# EAGLE design DimmerRGB_RevA (EAGLE 7.4.0)
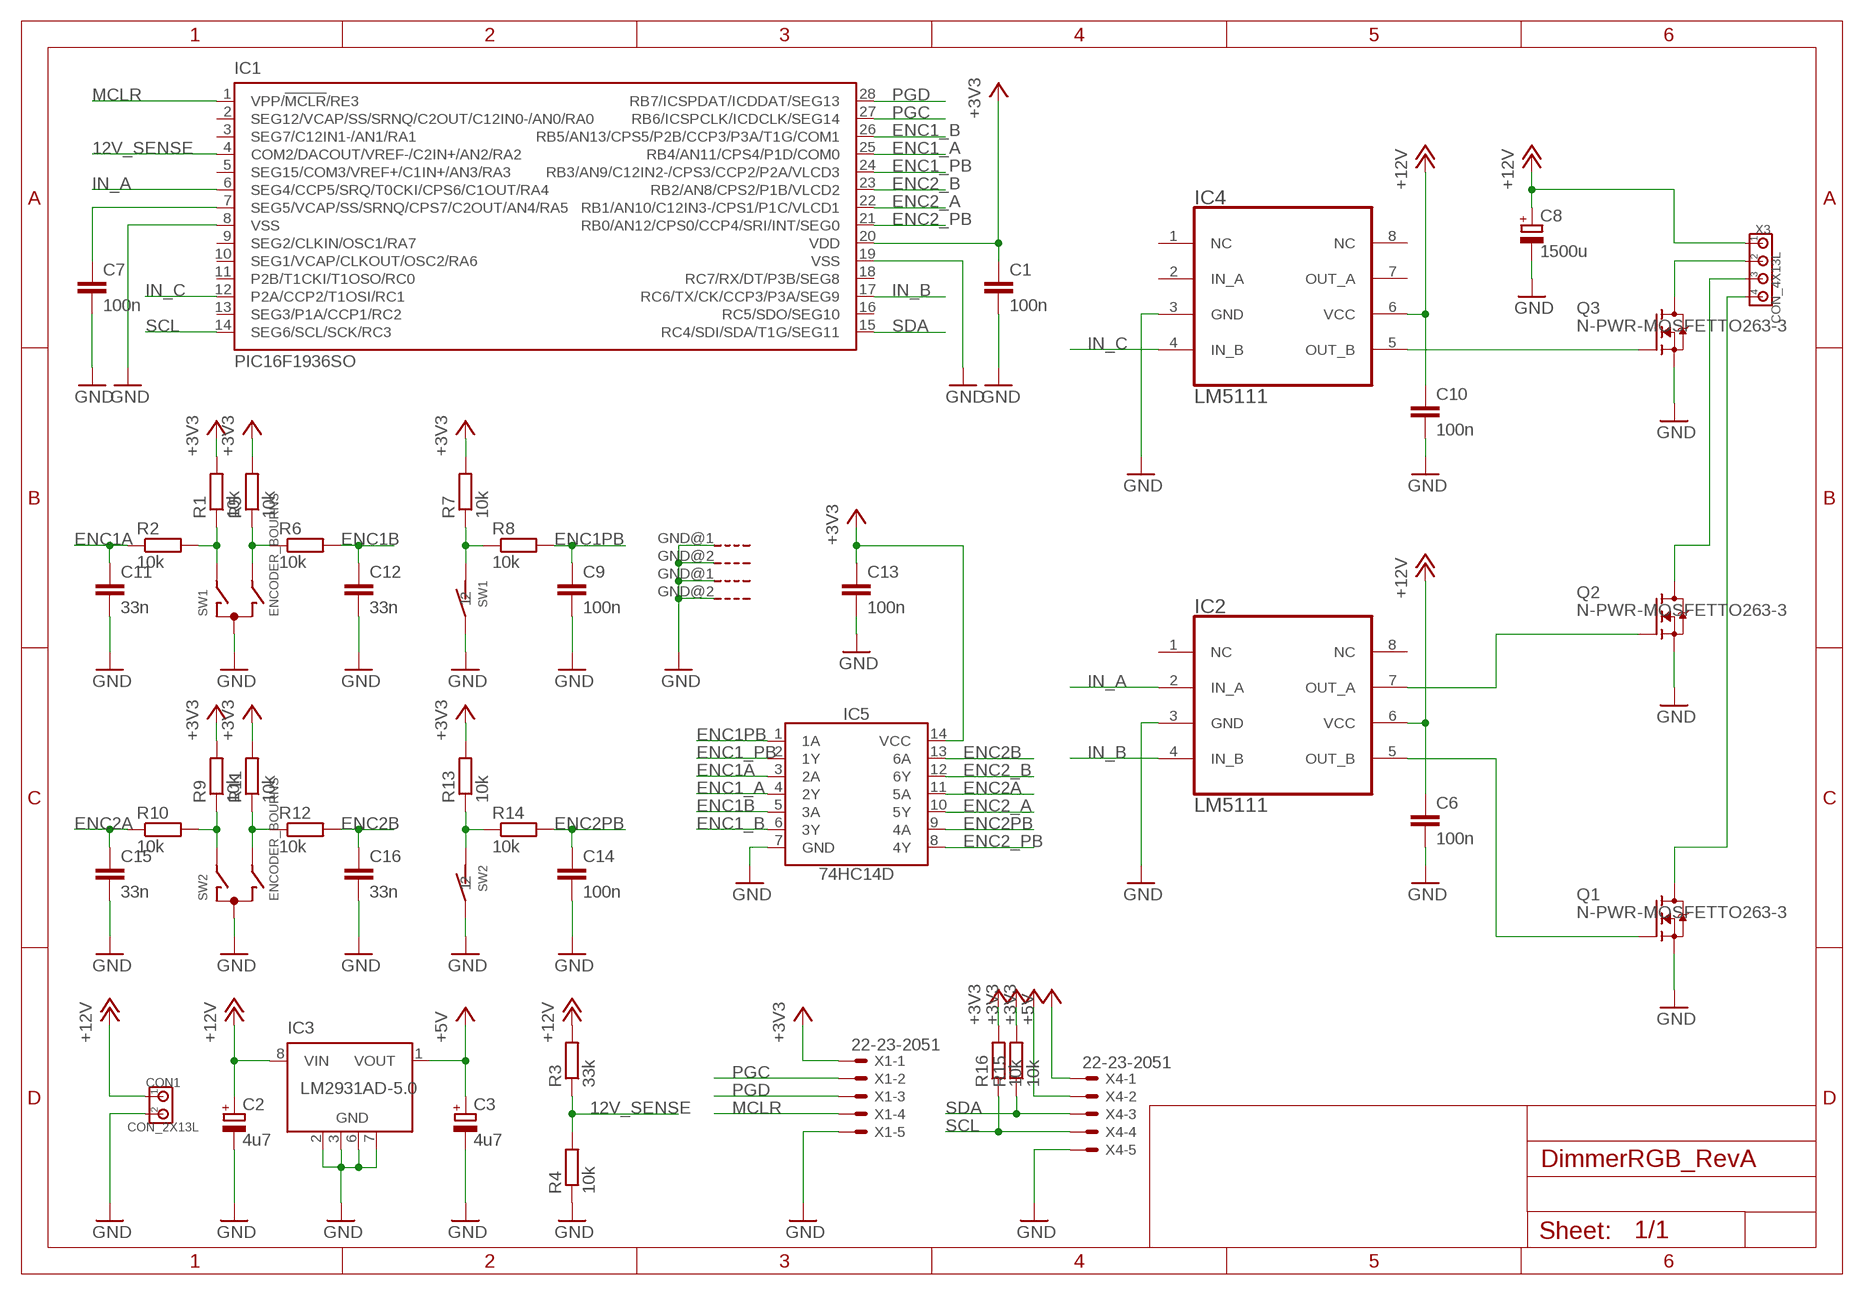
[diagram p0: schematic, sheet 1]

## Parts
C1  100n  CC0805  [C0805]
C2  4u7  C_POLARIZEDSMC_C  [SMC_C]
C3  4u7  C_POLARIZEDSMC_C  [SMC_C]
C6  100n  CC0805  [C0805]
C7  100n  CC0805  [C0805]
C8  1500u  C_POLARIZED10MM  [10MM]
C9  100n  CC0805  [C0805]
C10  100n  CC0805  [C0805]
C11  33n  CC0805  [C0805]
C12  33n  CC0805  [C0805]
C13  100n  CC0805  [C0805]
C14  100n  CC0805  [C0805]
C15  33n  CC0805  [C0805]
C16  33n  CC0805  [C0805]
CON1  CON_2X13L  [200MIL_2X]
IC1  PIC16F1936SO  [SO28W]
IC2  LM5111  [SOIC8]
IC3  LM2931AD-5.0  [SO8]
IC4  LM5111  [SOIC8]
IC5  74HC14D  [SO14]
Q1  N-PWR-MOSFETTO263-3  [TO263-3]
Q2  N-PWR-MOSFETTO263-3  [TO263-3]
Q3  N-PWR-MOSFETTO263-3  [TO263-3]
R1  10k  RESISTORR0805  [R0805]
R2  10k  RESISTORR0805  [R0805]
R3  33k  RESISTORR0805  [R0805]
R4  10k  RESISTORR0805  [R0805]
R5  10k  RESISTORR0805  [R0805]
R6  10k  RESISTORR0805  [R0805]
R7  10k  RESISTORR0805  [R0805]
R8  10k  RESISTORR0805  [R0805]
R9  10k  RESISTORR0805  [R0805]
R10  10k  RESISTORR0805  [R0805]
R11  10k  RESISTORR0805  [R0805]
R12  10k  RESISTORR0805  [R0805]
R13  10k  RESISTORR0805  [R0805]
R14  10k  RESISTORR0805  [R0805]
R15  10k  RESISTORR0805  [R0805]
R16  10k  RESISTORR0805  [R0805]
SW1  ENCODER_BOURNS  [ENCODER_BOURNS]
SW2  ENCODER_BOURNS  [ENCODER_BOURNS]
X1  22-23-2051  [22-23-2051]
X3  CON_4X13L  [200MIL_4X]
X4  22-23-2051  [22-23-2051]

## Nets
12V_SENSE: IC1.4(COM2/DACOUT/VREF-/C2IN+/AN2/RA2) R3.1 R4.2
+3V3: C1.1 C13.1 IC1.20(VDD) IC5.14(VCC) R1.2 R5.2 R7.2 R9.2 R11.2 R13.2 R15.2 R16.2 X1.1 X4.2
+5V: C3.+ IC3.1(VOUT) X4.1
+12V: C2.+ C6.1 C8.+ C10.1 CON1.1 IC2.6(VCC) IC3.8(VIN) IC4.6(VCC) R3.2 X3.1
ENC1_A: IC1.25(RB4/AN11/CPS4/P1D/COM0) IC5.4(2Y)
ENC1_B: IC1.26(RB5/AN13/CPS5/P2B/CCP3/P3A/T1G/COM1) IC5.6(3Y)
ENC1_PB: IC1.24(RB3/AN9/C12IN2-/CPS3/CCP2/P2A/VLCD3) IC5.2(1Y)
ENC1A: C11.1 IC5.3(2A) R2.1
ENC1B: C12.1 IC5.5(3A) R6.2
ENC1PB: C9.1 IC5.1(1A) R8.2
ENC2_A: IC1.22(RB1/AN10/C12IN3-/CPS1/P1C/VLCD1) IC5.10(5Y)
ENC2_B: IC1.23(RB2/AN8/CPS2/P1B/VLCD2) IC5.12(6Y)
ENC2_PB: IC1.21(RB0/AN12/CPS0/CCP4/SRI/INT/SEG0) IC5.8(4Y)
ENC2A: C15.1 IC5.11(5A) R10.1
ENC2B: C16.1 IC5.13(6A) R12.2
ENC2PB: C14.1 IC5.9(4A) R14.2
GND: C1.2 C2.- C3.- C6.2 C7.2 C8.- C9.2 C10.2 C11.2 C12.2 C13.2 C14.2 C15.2 C16.2 CON1.2 IC1.8(VSS) IC1.19(VSS) IC2.3(GND) IC3.2(GND) IC3.3(GND) IC3.6(GND) IC3.7(GND) IC4.3(GND) IC5.7(GND) Q1.3(S) Q2.3(S) Q3.3(S) R4.1 SW1.2 SW1.C SW1.GND@1(G) SW1.GND@2(G) SW2.2 SW2.C SW2.GND@1(G) SW2.GND@2(G) X1.5 X4.5
IN_A: IC1.6(SEG4/CCP5/SRQ/T0CKI/CPS6/C1OUT/RA4) IC2.2(IN_A)
IN_B: IC1.17(RC6/TX/CK/CCP3/P3A/SEG9) IC2.4(IN_B)
IN_C: IC1.12(P2A/CCP2/T1OSI/RC1) IC4.4(IN_B)
MCLR: IC1.1(VPP/!MCLR!/RE3) X1.4
N$1: IC2.5(OUT_B) Q1.1(G)
N$2: Q1.TAB(D) X3.4
N$4: Q2.TAB(D) X3.3
N$5: C7.1 IC1.7(SEG5/VCAP/SS/SRNQ/CPS7/C2OUT/AN4/RA5)
N$6: IC2.7(OUT_A) Q2.1(G)
N$11: IC4.5(OUT_B) Q3.1(G)
N$12: Q3.TAB(D) X3.2
N$13: R5.1 R6.1 SW1.B
N$14: R1.1 R2.2 SW1.A
N$15: R7.1 R8.1 SW1.1
N$16: R11.1 R12.1 SW2.B
N$17: R9.1 R10.2 SW2.A
N$18: R13.1 R14.1 SW2.1
PGC: IC1.27(RB6/ICSPCLK/ICDCLK/SEG14) X1.2
PGD: IC1.28(RB7/ICSPDAT/ICDDAT/SEG13) X1.3
SCL: IC1.14(SEG6/SCL/SCK/RC3) R16.1 X4.4
SDA: IC1.15(RC4/SDI/SDA/T1G/SEG11) R15.1 X4.3
Unconnected: IC1.2(SEG12/VCAP/SS/SRNQ/C2OUT/C12IN0-/AN0/RA0) IC1.3(SEG7/C12IN1-/AN1/RA1) IC1.5(SEG15/COM3/VREF+/C1IN+/AN3/RA3) IC1.9(SEG2/CLKIN/OSC1/RA7) IC1.10(SEG1/VCAP/CLKOUT/OSC2/RA6) IC1.11(P2B/T1CKI/T1OSO/RC0) IC1.13(SEG3/P1A/CCP1/RC2) IC1.16(RC5/SDO/SEG10) IC1.18(RC7/RX/DT/P3B/SEG8) IC2.1(NC) IC2.8(NC) IC4.1(NC) IC4.2(IN_A) IC4.7(OUT_A) IC4.8(NC)

## Library data of the parts
C1 C6 C7 C9-C16 = 00Capacitor:C: Capacitor
C2 C3 C8 = 00Capacitor:C_POLARIZED
CON1 = 00Connector:CON_2X: 2-pin header
IC1 = 00PIC:PIC16F19*: Flash-Based, 8-Bit CMOS Microcontroller; EEPROM: 256; FLASH: 8192; RAM: 512
IC2 IC4 = 00Logic:LM5111: Dual 5A Compound Gate Driver
IC3 = 00VoltageRegulator:LM2931*
IC5 = 00Logic:74HC14: Hex Inverter Schmitt Trigger
Q1-Q3 = 00Mosfet:N-PWR-MOSFET
R1-R16 = 00Resistor:RESISTOR: RESISTOR, European symbol
SW1 SW2 = 00Switch:ENCODER_BOURNS: Bourns Rotary Encoder with Switch PEC11-4xxxF-Sxxxx
X1 X4 = 00Connector:22-23-2051: .100" (2.54mm) Center Header - 5 Pin; MF: MOLEX; MPN: 22-23-2051; OC_FARNELL: 1462952; OC_NEWARK: 38C9178
X3 = 00Connector:CON_4X: 4-pin header

## Board
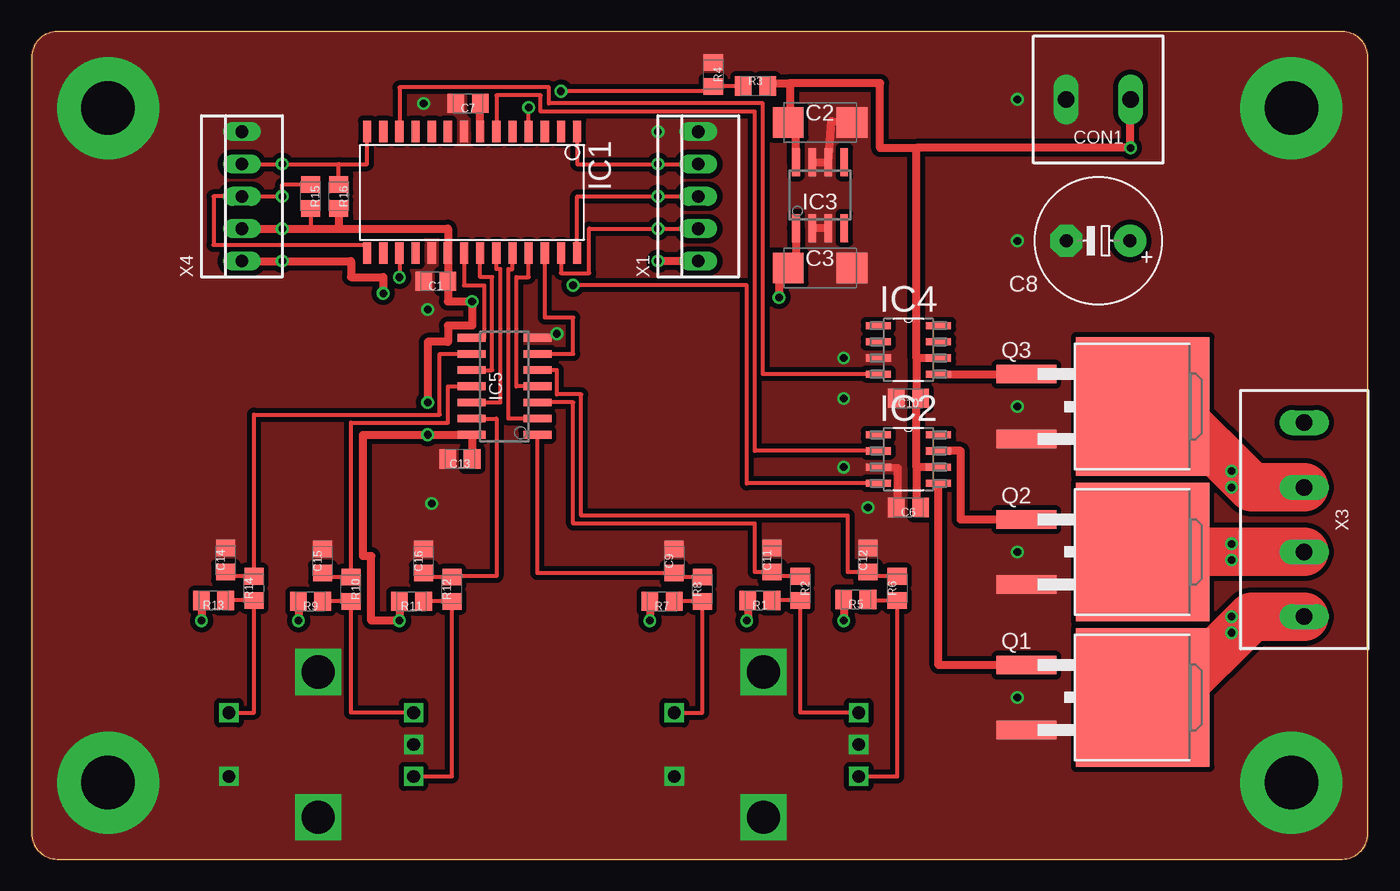
[diagram p1: board, top side]
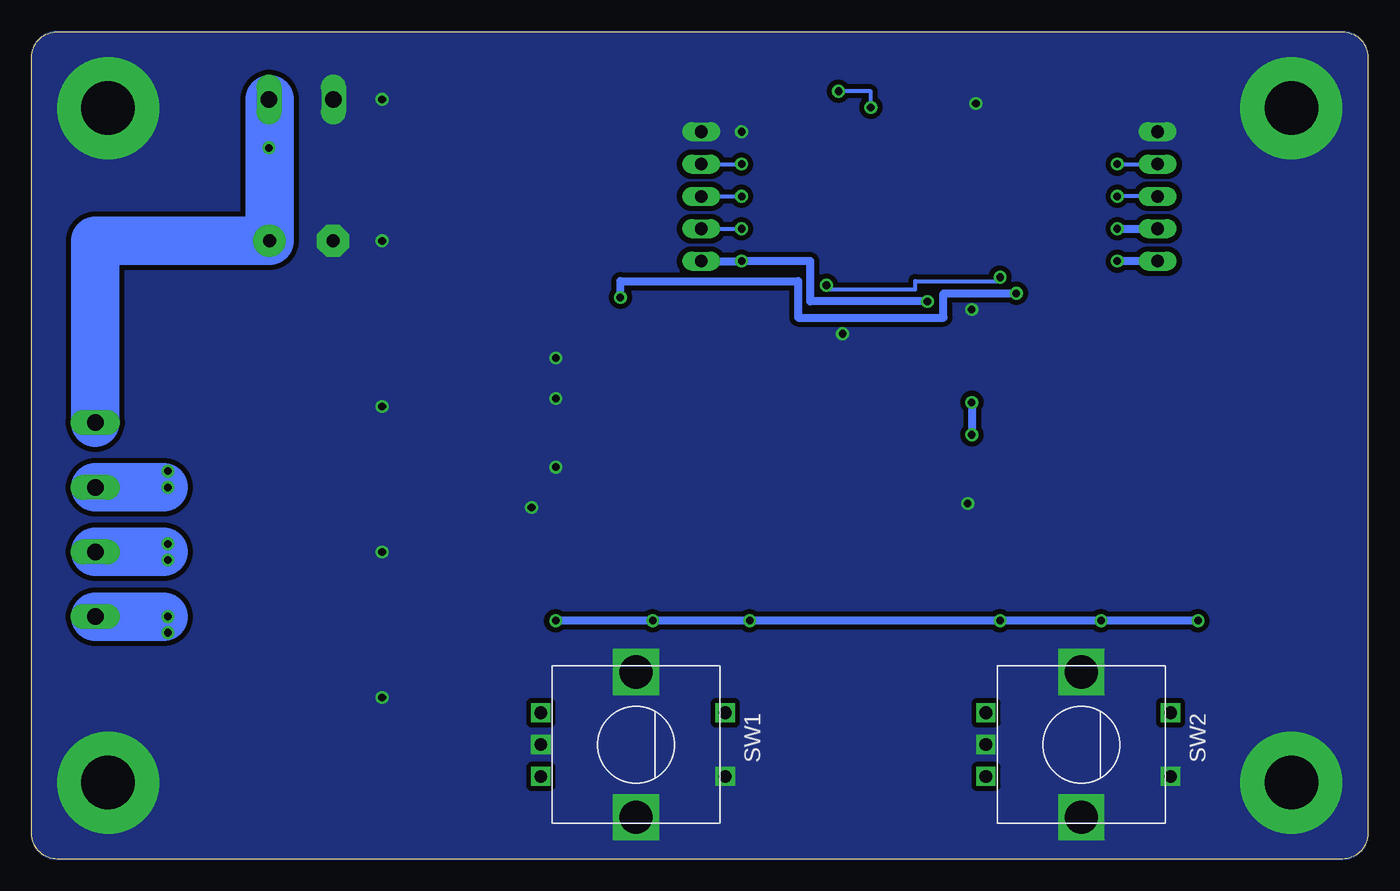
[diagram p2: board, bottom side, seen from below]

Size 105 x 65 mm. Coordinates in mm from the lower left corner, seen from the top.
Outline: 103,0 arc90 105,2 105,63 arc90 103,65 2,65 arc90 0,63 0,2 arc90 2,0 103,0
Copper layers (1*16): Top 0.035mm / dielectric 1.5mm / Bottom 0.035mm
Design rules "default *": minimum track width 10mil, minimum drill 24mil, track to track 8mil, track to pad 8mil, pad to pad 8mil, via to via 8mil, smd to smd 8mil, copper to edge 0mil, drill to drill 8mil, minimum pad ring 10mil, minimum via ring 8mil, stop-mask expansion 4mil, vias tented up to drill 0mil, thermal gap 10mil

### Footprints (pad centres in the part's own frame; a part is rotated, then mirrored left to right if it is on the bottom)
C0805 = smd 1.3 x 1.5: 1 -0.95,0; 2 0.95,0
SMC_C = smd 2.4 x 2.4: + -2.5,0; - 2.5,0
10MM = drill 1.016 pad 2.54: + -2.5,0 | drill 1.016 pad 2.54 octagon: - 2.5,0
200MIL_2X = drill 1.3 long: 1 -2.54,0; 2 2.54,0
SO28W = smd 0.65 x 1.7: 1 -7.62,-4.78; 2 -6.35,-4.78; 3 -5.08,-4.78; 4 -3.81,-4.78; 5 -2.54,-4.78; 6 -1.27,-4.78; 7 0,-4.78; 8 1.27,-4.78; 9 2.54,-4.78; 10 3.81,-4.78; 11 5.08,-4.78; 12 6.35,-4.78; 13 7.62,-4.78; 14 8.89,-4.78; 15 8.89,4.78; 16 7.62,4.78; 17 6.35,4.78; 18 5.08,4.78; 19 3.81,4.78; 20 2.54,4.78; 21 1.27,4.78; 22 0,4.78; 23 -1.27,4.78; 24 -2.54,4.78; 25 -3.81,4.78; 26 -5.08,4.78; 27 -6.35,4.78; 28 -7.62,4.78
SOIC8 = smd 1.981 x 0.559: 1 -2.362,1.905; 2 -2.362,0.635; 3 -2.362,-0.635; 4 -2.362,-1.905; 5 2.362,-1.905; 6 2.362,-0.635; 7 2.362,0.635; 8 2.362,1.905
SO8 = smd 2.2 x 0.6: 1 -2.6,1.905; 2 -2.6,0.635; 3 -2.6,-0.635; 4 -2.6,-1.905; 5 2.6,-1.905; 6 2.6,-0.635; 7 2.6,0.635; 8 2.6,1.905
SO14 = smd 0.6 x 2.2: 1 -3.81,-2.6; 2 -2.54,-2.6; 3 -1.27,-2.6; 4 0,-2.6; 5 1.27,-2.6; 6 2.54,-2.6; 7 3.81,-2.6; 8 3.81,2.6; 9 2.54,2.6; 10 1.27,2.6; 11 0,2.6; 12 -1.27,2.6; 13 -2.54,2.6; 14 -3.81,2.6
TO263-3 = smd 1.45 x 4.7: 1 -2.54,-5.65; 3 2.54,-5.65 | smd 10.9 x 10.5: TAB 0,3.5
R0805 = smd 1.3 x 1.5: 1 -0.95,0; 2 0.95,0
ENCODER_BOURNS = drill 1 square: 1 -2.5,7; 2 2.5,7; A -2.5,-7.5; B 2.5,-7.5; C 0,-7.5 | drill 2.6 square: GND@1 -5.7,0; GND@2 5.7,0
22-23-2051 = drill 1 long: 1 -5.08,0; 2 -2.54,0; 3 0,0; 4 2.54,0; 5 5.08,0
200MIL_4X = drill 1.3 long: 1 -7.62,0; 2 -2.54,0; 3 2.54,0; 4 7.62,0

### Placement (x,y rotation side)
C1  31.75,45.4 180 top
C2  61.96,57.88 0 top
C3  61.96,46.45 0 top
C6  68.9,27.62 180 top
C7  34.29,59.37 180 top
C8  83.82,48.58 180 top
C9  50.48,23.42 90 top
C10  68.9,36.2 180 top
C11  58.18,23.5 90 top
C12  65.72,23.5 90 top
C13  33.66,31.43 180 top
C14  15.24,23.5 90 top
C15  22.86,23.42 90 top
C16  30.8,23.42 90 top
CON1  83.82,59.69 180 top
IC1  35.24,52.39 180 top
IC2  68.9,31.43 0 top
IC3  61.96,52.17 90 top
IC4  68.9,40.01 0 top
IC5  37.15,37.15 90 top
Q1  83.82,12.7 270 top
Q2  83.82,24.13 270 top
Q3  83.82,35.56 270 top
R1  57.23,20.32 180 top
R2  60.4,21.27 270 top
R3  56.88,60.74 0 top
R4  53.56,61.65 270 top
R5  64.77,20.39 180 top
R6  68.02,21.27 90 top
R7  49.53,20.25 180 top
R8  52.7,21.2 90 top
R9  21.91,20.25 180 top
R10  25.08,21.2 270 top
R11  29.84,20.25 180 top
R12  33.02,21.2 90 top
R13  14.29,20.32 180 top
R14  17.46,21.27 90 top
R15  21.91,52.07 270 top
R16  24.13,52.07 270 top
SW1  57.5,9 270 bottom
SW2  22.5,9 270 bottom
X1  52.39,52.07 90 top
X3  100.01,26.67 270 top
X4  16.51,52.07 90 top

### Tracks (layer width: path | path; a pad name or v marks a point on that pad's centre or on a via)
12V_SENSE  (via drill 0.6)
  Top 0.305: R3.1 53.56,60.74 R4.2 53.56,60.33 v41.59,60.33 | IC1.4 v39.05,59.05
  Bottom 0.305: v39.05,59.05 39.05,60.33 v41.59,60.33
+3V3  (via drill 0.6)
  Top 0.305: R15.2 21.91,49.53
  Top 0.61: 34.6,33.34 IC5.14 v31.11,33.34 26.04,33.34 26.04,23.81 26.67,23.81 26.67,18.73 v28.89,18.73 R11.2 | 34.6,33.34 C13.1 | R5.2 v63.82,18.73 | R7.2 v48.58,18.73 | R1.2 56.27,18.73 v56.2,18.73 | R9.2 v20.96,18.73 v20.95,18.73 | R13.2 v13.34,18.73 | v31.11,35.88 31.11,40.64 32.7,40.64 32.7,41.91 34.61,41.91 v34.61,43.81 32.7,43.81 C1.1 IC1.20 32.7,49.53 24.13,49.53 | X4.2 v19.68,49.53 21.91,49.53 24.13,49.53 | X1.1 v49.21,46.99 | R16.2 24.13,49.53 | 34.6,33.34 34.61,33.34
  Bottom 0.61: v13.34,18.73 v20.95,18.73 v28.89,18.73 v48.58,18.73 v56.2,18.73 v63.82,18.73 | v31.11,35.88 v31.11,33.34 | v34.61,43.81 43.81,43.81 43.81,46.99 v49.21,46.99 X1.1 | v19.68,49.53 X4.2
+5V  (via drill 0.6)
  Top 0.61: IC3.1 60.06,46.13 C3.+ 58.74,46.45 v58.74,44.13 | X4.1 25.08,46.99 25.08,45.72 27.62,45.72 v27.62,44.45
  Bottom 0.61: v58.74,44.13 58.74,45.4 44.77,45.4 44.77,42.55 33.34,42.55 33.34,44.45 v27.62,44.45 | X4.1 v19.68,46.99
+12V  (via drill 0.6)
  Top 0.61: R3.2 57.78,60.96 59.62,60.96 | IC3.8 60.06,57.88 C2.+ 59.62,57.98 59.62,60.96 | IC4.6 69.53,39.37 | 69.53,39.37 69.53,36.2 | IC2.6 69.53,30.8 | 69.53,30.8 69.53,27.62 C6.1 | 69.53,30.8 69.53,36.2 | 69.53,36.2 C10.1 | 69.53,39.37 69.53,55.88 | 69.53,55.88 v86.36,55.88 CON1.1 | 59.62,60.96 66.67,60.96 66.67,55.88 69.53,55.88
  Bottom 0.61: CON1.1 86.32,59.69
  Bottom 3.81: 86.32,59.69 C8.+ 100.01,48.58 X3.1
ENC1_A
  Top 0.305: IC5.4 38.1,37.15 38.1,45.72 39.05,45.72 IC1.25
ENC1_B
  Top 0.305: IC5.6 42.55,39.69 42.55,42.55 40.32,42.55 IC1.26
ENC1_PB
  Top 0.305: IC5.2 37.47,34.61 37.47,46.35 37.78,46.35 IC1.24
ENC1A
  Top 0.305: R2.1 58.18,22.22 C11.1 56.83,22.55 56.83,26.35 42.55,26.35 42.55,35.88 IC5.3
ENC1B
  Top 0.305: R6.2 65.72,22.22 C12.1 64.14,22.55 64.14,26.99 43.18,26.99 43.18,36.51 41.27,36.51 41.27,38.42 IC5.5
ENC1PB
  Top 0.305: R8.2 50.48,22.15 C9.1 39.75,22.47 IC5.1
ENC2_A
  Top 0.305: IC5.10 36.2,38.42 36.2,45.72 35.24,45.72 IC1.22
ENC2_B
  Top 0.305: IC5.12 36.83,35.88 36.83,46.35 36.51,46.35 IC1.23
ENC2_PB
  Top 0.305: 33.97,40.96 IC5.8 35.56,40.96 35.56,45.09 33.97,45.09 IC1.21
ENC2A
  Top 0.305: C15.1 22.86,22.15 R10.1 25.08,34.29 32.7,34.29 32.7,37.15 IC5.11
ENC2B
  Top 0.305: C16.1 30.8,22.15 R12.2 33.02,22.23 36.51,22.23 36.51,34.61 IC5.13
ENC2PB
  Top 0.305: C14.1 arc90 15.56,22.22 R14.2 17.46,34.92 32.07,34.92 32.07,39.69 IC5.9
GND  (via drill 0.6, 4.2 pad 8)
  Top 0.61: IC2.3 68.05,30.74 68.05,27.88 arc-90 C6.2 | IC3.7 IC3.6 62.87,57.98 C2.- | IC3.3 IC3.2
  other vias: 6,6 99,6 6,59 99,59 41.27,41.27 49.21,57.15 31.43,27.94 77.47,59.69 77.47,48.58 77.47,35.56 77.47,24.13 77.47,12.7 30.8,59.37 31.11,43.18 63.82,39.37 63.82,36.2 63.82,30.8 65.72,27.62
  pour Bottom (isolate 0.4, no thermals): 103,0 2,0 arc-90 0,2 0,63 arc-90 2,65 103,65 arc-90 105,63 105,2 arc-90
  pour Top (isolate 0.4, no thermals): 0,2 0,63 arc-90 2,65 103,65 arc-90 105,63 105,2 arc-90 103,0 2,0 arc-90
IN_A
  Top 0.305: IC2.2 56.83,32.07 56.83,58.74 40.01,58.74 40.01,60.01 36.51,60.01 IC1.6
IN_B  (via drill 0.6)
  Top 0.305: IC2.4 56.2,29.53 56.2,45.09 v42.55,45.09 | IC1.17 v28.89,45.72
  Bottom 0.305: v42.55,45.09 42.55,44.77 35.56,44.77 35.56,45.4 28.89,45.4 v28.89,45.72
IN_C
  Top 0.305: IC4.4 57.47,38.1 57.47,59.37 40.64,59.37 40.64,60.64 28.89,60.64 IC1.12
MCLR  (via drill 0.6)
  Top 0.305: IC1.1 42.86,54.61 v49.21,54.61 X1.4
  Bottom 0.305: X1.4 v49.21,54.61
N$1
  Top 0.61: Q1.1 71.26,15.24 IC2.5
N$2  (via drill 0.6)
  Top 0.61: v94.3,17.78 v94.3,19.05 X3.4
  Top 3.81: Q1.TAB 89.53,12.7 95.89,19.05 X3.4
  Bottom 3.81: X3.4 94.61,19.05
N$4  (via drill 0.6)
  Top 0.61: v94.3,23.5 94.3,24.13 v94.3,24.77
  Top 3.81: Q2.TAB 94.3,24.13 X3.3
  Bottom 3.81: X3.3 94.61,24.13
N$5
  Top 0.61: IC1.7 C7.1
N$6
  Top 0.61: Q2.1 73.03,26.67 73.03,32.07 IC2.7
N$11
  Top 0.61: IC4.5 Q3.1
N$12  (via drill 0.6)
  Top 0.61: v94.3,30.48 v94.3,29.21 X3.2
  Top 3.81: Q3.TAB 89.53,35.56 95.89,29.21 X3.2
  Bottom 3.81: X3.2 94.61,29.21
N$13
  Top 0.305: R5.1 65.72,20.32 R6.1 68.02,6.5 SW1.B
N$14
  Top 0.305: SW1.A 60.4,11.5 R2.2 R1.1
N$15
  Top 0.305: R7.1 R8.1 52.7,11.5 SW1.1
N$16
  Top 0.305: R11.1 R12.1 33.02,6.5 SW2.B
N$17
  Top 0.305: R9.1 R10.2 25.08,11.5 SW2.A
N$18
  Top 0.305: R13.1 arc-90 R13.1 R14.1 17.46,11.5 SW2.1
PGC  (via drill 0.6)
  Top 0.305: X1.2 v49.21,49.53 43.81,49.53 43.81,46.04 41.59,46.04 IC1.27
  Bottom 0.305: X1.2 v49.21,49.53
PGD  (via drill 0.6)
  Top 0.305: IC1.28 42.86,52.07 v49.21,52.07 X1.3
  Bottom 0.305: X1.3 v49.21,52.07
SCL  (via drill 0.6)
  Top 0.305: X4.4 v19.68,54.61 24.13,54.61 | 24.13,54.61 26.35,54.61 IC1.14 | R16.1 24.13,54.61
  Bottom 0.305: v19.68,54.61 X4.4
SDA  (via drill 0.6)
  Top 0.305: IC1.15 26.35,48.26 14.29,48.26 14.29,52.07 X4.3 v19.68,52.07 19.68,53.02 R15.1
  Bottom 0.305: X4.3 v19.68,52.07

### Text on the board
tText: Lukas Fässler 2015